# EAGLE schematic LFO_CGS_v2 (EAGLE 7.3.0)
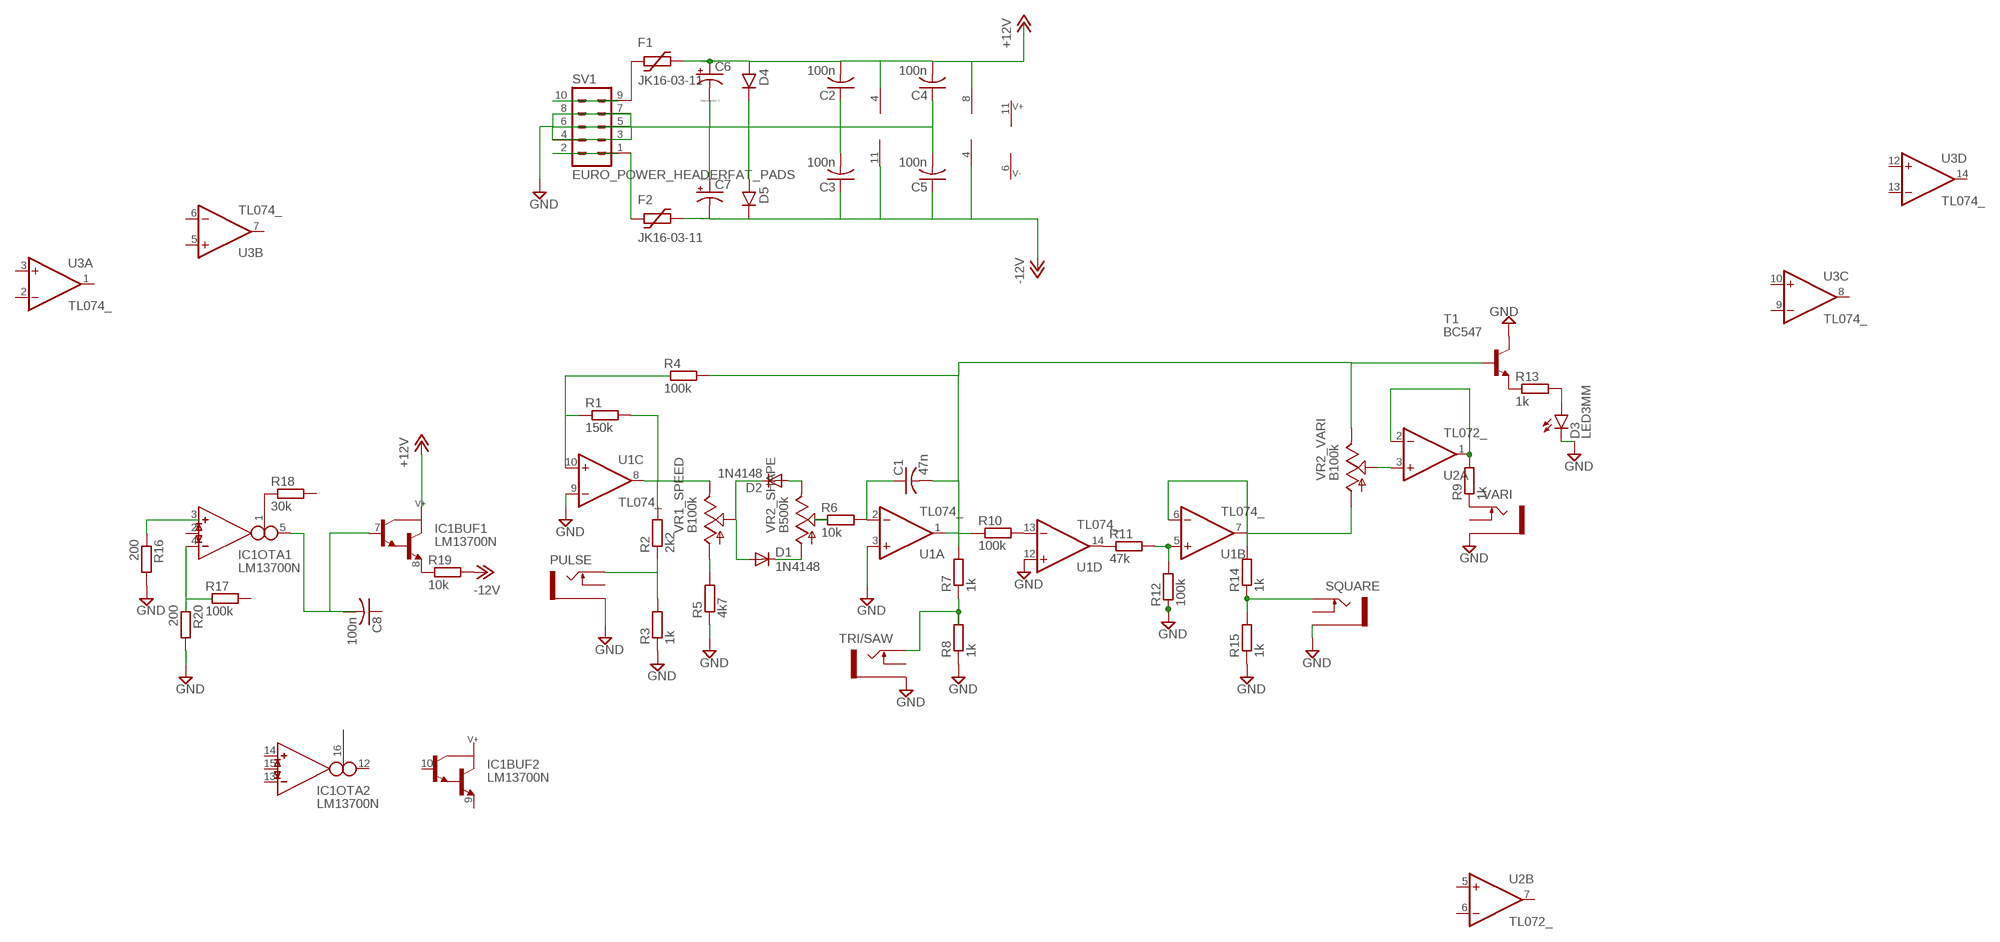
[diagram p0: schematic, sheet 1]

## Parts
C1  47n  C-US025-025X050  [C025-025X050]
C2  100n  C-US025-025X050  [C025-025X050]
C3  100n  C-US025-025X050  [C025-025X050]
C4  100n  C-US025-025X050  [C025-025X050]
C5  100n  C-US025-025X050  [C025-025X050]
C6  CPOL-USE2.5-6  [E2,5-6]
C7  CPOL-USE2.5-6  [E2,5-6]
C8  100n  C-US025-025X050  [C025-025X050]
D1  1N4148  SMALL_DIODEDO35-7  [DO35-7]
D2  1N4148  SMALL_DIODEDO35-7  [DO35-7]
D3  LED3MM  [LED3MM]
D4  1N400X.1  [DO41-1]
D5  1N400X.1  [DO41-1]
F1  JK16-03-11  [JK16-03-11]
F2  JK16-03-11  [JK16-03-11]
IC1  LM13700N  [DIL16]
PULSE  THONKICONNNEW  [WQP-PJ301M-12_JACK]
R1  150k  RESISTORVERTICAL  [VERTICAL_RESISTOR]
R2  2k2  RESISTORVERTICAL  [VERTICAL_RESISTOR]
R3  1k  RESISTORVERTICAL  [VERTICAL_RESISTOR]
R4  100k  RESISTORVERTICAL  [VERTICAL_RESISTOR]
R5  4k7  RESISTORVERTICAL  [VERTICAL_RESISTOR]
R6  10k  RESISTORVERTICAL  [VERTICAL_RESISTOR]
R7  1k  RESISTORVERTICAL  [VERTICAL_RESISTOR]
R8  1k  RESISTORVERTICAL  [VERTICAL_RESISTOR]
R9  1k  RESISTORVERTICAL  [VERTICAL_RESISTOR]
R10  100k  RESISTORVERTICAL  [VERTICAL_RESISTOR]
R11  47k  RESISTORVERTICAL  [VERTICAL_RESISTOR]
R12  100k  RESISTORVERTICAL  [VERTICAL_RESISTOR]
R13  1k  RESISTORVERTICAL  [VERTICAL_RESISTOR]
R14  1k  RESISTORVERTICAL  [VERTICAL_RESISTOR]
R15  1k  RESISTORVERTICAL  [VERTICAL_RESISTOR]
R16  200  RESISTORVERTICAL  [VERTICAL_RESISTOR]
R17  100k  RESISTORVERTICAL  [VERTICAL_RESISTOR]
R18  30k  RESISTORVERTICAL  [VERTICAL_RESISTOR]
R19  10k  RESISTORVERTICAL  [VERTICAL_RESISTOR]
R20  200  RESISTORVERTICAL  [VERTICAL_RESISTOR]
SQUARE  THONKICONNNEW  [WQP-PJ301M-12_JACK]
SV1  EURO_POWER_HEADERFAT_PADS  [EURO_PWR_HEADER_FAT]
T1  BC547  -NPN-TO92  [TO92]
TRI/SAW  THONKICONNNEW  [WQP-PJ301M-12_JACK]
U1  TL074_  [DIL14]
U2  TL072_  [DIL08]
U3  TL074_  [DIL14]
VARI  THONKICONNNEW  [WQP-PJ301M-12_JACK]
VR1_SPEED  B100k  9MM_SNAP-IN_POT_  [9MM_SNAP-IN_POT]
VR2_SHAPE  B500k  9MM_SNAP-IN_POT_  [9MM_SNAP-IN_POT]
VR2_VARI  B100k  9MM_SNAP-IN_POT_  [9MM_SNAP-IN_POT]

## Nets
+12V: C2.2 C4.2 C6.+ D4.A F1.P$2 U1.4(P:V+) U2.8(P:V+)
-12V: C3.1 C5.1 C7.- D5.C F2.P$2 R19.2 U1.11(P:V-) U2.4(P:V-)
GND: C2.1 C3.2 C4.1 C5.2 C6.- C7.+ D3.K(C) D4.C D5.A PULSE.P$3_SLEEVE(SLEEVE) R3.1 R5.1 R8.1 R12.1 R15.1 R16.2 R20.2 SQUARE.P$3_SLEEVE(SLEEVE) SV1.3 SV1.4 SV1.5 SV1.6 SV1.7 SV1.8 T1.3(C) TRI/SAW.P$3_SLEEVE(SLEEVE) U1.3(A:+IN) U1.9(C:-IN) U1.12(D:+IN) VARI.P$3_SLEEVE(SLEEVE)
N$1: R1.1 U1.10(C:+IN)
N$2: R1.2 R2.2 U1.8(C:OUT) VR1_SPEED.3(E)
N$3: PULSE.P$1_TIP(TIP) R2.1 R3.2
N$4: R5.2 VR1_SPEED.1(A)
N$5: D1.A D2.C VR1_SPEED.2(S)
N$6: D1.C VR2_SHAPE.1(A)
N$7: D2.A VR2_SHAPE.3(E)
N$8: C1.1 R6.2 U1.2(A:-IN)
N$9: R6.1 VR2_SHAPE.2(S)
N$10: C1.2 R4.2 R7.2 R10.1 T1.2(B) U1.1(A:OUT) VR2_VARI.3(E)
N$11: R7.1 R8.2 TRI/SAW.P$1_TIP(TIP)
N$12: R11.1 U1.14(D:OUT)
N$13: R10.2 U1.13(D:-IN)
N$14: R11.2 R12.2 U1.5(B:+IN)
N$15: R14.2 U1.6(B:-IN) U1.7(B:OUT) VR2_VARI.1(A)
N$16: R14.1 R15.2 SQUARE.P$1_TIP(TIP)
N$17: D3.A R13.2
N$18: U2.3(A:+IN) VR2_VARI.2(S)
N$19: R9.2 U2.1(A:OUT) U2.2(A:-IN)
N$20: R9.1 VARI.P$1_TIP(TIP)
N$21: R13.1 T1.1(E)
N$22: F2.P$1 SV1.1
N$23: F1.P$1 SV1.9
N$24: R16.1
N$25: SV1.2
N$26: IC1.4(OTA1:IN_N)
N$27: IC1.1(OTA1:I_BIAS) R18.1
N$28: IC1.5(OTA1:OUT) IC1.7(BUF1:B)
N$29: SV1.10
N$31: IC1.8(BUF1:E) R19.1
Unconnected: C8.1 C8.2 IC1.2(OTA1:I_DIODE) IC1.3(OTA1:IN_P) IC1.6(SUPPLY:V-) IC1.9(BUF2:E) IC1.10(BUF2:B) IC1.11(SUPPLY:V+) IC1.12(OTA2:OUT) IC1.13(OTA2:IN_N) IC1.14(OTA2:IN_P) IC1.15(OTA2:I_DIODE) IC1.16(OTA2:I_BIAS) PULSE.P$2_SWITCH(SWITCH) R4.1 R17.1 R17.2 R18.2 R20.1 SQUARE.P$2_SWITCH(SWITCH) TRI/SAW.P$2_SWITCH(SWITCH) U2.5(B:+IN) U2.6(B:-IN) U2.7(B:OUT) U3.1(A:OUT) U3.2(A:-IN) U3.3(A:+IN) U3.5(B:+IN) U3.6(B:-IN) U3.7(B:OUT) U3.8(C:OUT) U3.9(C:-IN) U3.10(C:+IN) U3.12(D:+IN) U3.13(D:-IN) U3.14(D:OUT) VARI.P$2_SWITCH(SWITCH)

## Power pins joined to a net without a drawn wire
V+: U3.4(P:V+)
V-: U3.11(P:V-)

## Library data of the parts
C1-C5 C8 = resistor:C-US: CAPACITOR, American symbol
C6 C7 = resistor:CPOL-US: POLARIZED CAPACITOR, American symbol
D1 D2 = MusicThingModular:SMALL_DIODE: Small Signal Diode
D3 = gm-diodes:LED
D4 D5 = gm-diodes:1N400X: Rectifier Diodes often used in power supply to prevent damage from reverse polarization
F1 F2 = ptc-littlefuse:JK16-03-11
IC1 = ota:LM13700: Dual OTA with buffers
PULSE SQUARE TRI/SAW VARI = MusicThingModular:THONKICONN: 3.5mm socket for Eurorack modular synths
R1-R20 = MusicThingModular:RESISTOR: Standard resistor, various versions
SV1 = MusicThingModular:EURO_POWER_HEADER: Power Header 10 pin power header for Eurorack Power Supplies Variants with fatter pads for easier soldering, and the LOCK variant which has 5mil offset pins to hold the component in place before soldering
T1 = MusicThingModular:*-NPN-: NPN Transistror BF959 corrected 2008.03.06
U1 U3 = MusicThingModular:TL074: Generic Quad Op Amp
U2 = MusicThingModular:TL072: Generic Dual Op Amp
VR1_SPEED VR2_SHAPE VR2_VARI = MusicThingModular:9MM_SNAP-IN_POT: 9mm vertical snap-in pot, Alpha / Panasonic style